# Altium schematic sheet Tp_7seg_Drivers.SchDoc
size A4
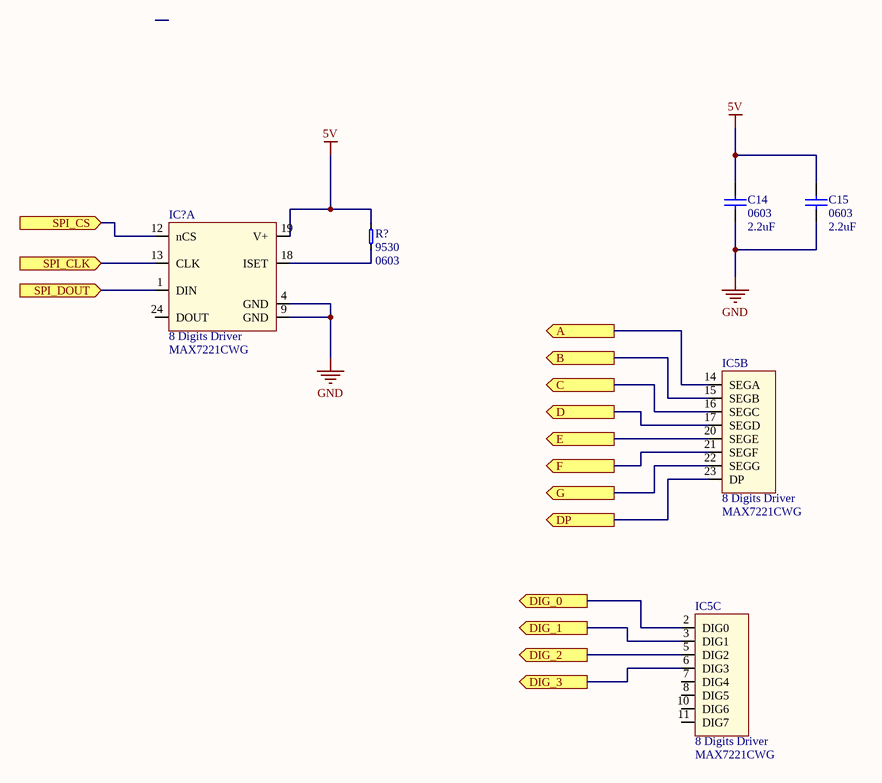
[diagram p0: Tp_7seg_Drivers.SchDoc]

## Parts
C14  0603  value 2.2uF  [RAD-0.3]
C15  0603  value 2.2uF  [RAD-0.3]
IC5  8 Digits Driver  [MAX7221CWG]  (parts B,C of 3)
IC?  8 Digits Driver  [MAX7221CWG]  (part A of 3)
R?  value 9530  Package: 0603  [0603_RES_LD]  (hidden comment: Resistor)

## Ports
A (out), B (out), C (out), D (out), DIG_0 (out), DIG_1 (out), DIG_2 (out), DIG_3 (out), DP (out), E (out), F (out), G (out), SPI_CLK (in), SPI_CS (in), SPI_DOUT (in)

## Nets
5V: C14.2 C15.2 IC?.19(V+) R?.2
GND: C14.1 C15.1 IC?.4(GND) IC?.9(GND)
A: IC5.14(SEGA) ; port A
B: IC5.15(SEGB) ; port B
C: IC5.16(SEGC) ; port C
D: IC5.17(SEGD) ; port D
DIG_0: IC5.2(DIG0) ; port DIG_0
DIG_1: IC5.3(DIG1) ; port DIG_1
DIG_2: IC5.5(DIG2) ; port DIG_2
DIG_3: IC5.6(DIG3) ; port DIG_3
DP: IC5.23(DP) ; port DP
E: IC5.20(SEGE) ; port E
F: IC5.21(SEGF) ; port F
G: IC5.22(SEGG) ; port G
SPI_CLK: IC?.13(CLK) ; port SPI_CLK
SPI_CS: IC?.12(nCS) ; port SPI_CS
SPI_DOUT: IC?.1(DIN) ; port SPI_DOUT
NetIC?_18: IC?.18(ISET) R?.1

Not connected (* = marked no-connect by the designer): IC5 7(DIG4) 8(DIG5) 10(DIG6) 11(DIG7); IC? 24(DOUT)

## Library data of the parts
C14 C15 = Cap: Capacitor; Published: 8-Jun-2000; LatestRevisionDate: 17-Jul-2002; LatestRevisionNote: Re-released for DXP Platform.; PackageReference: RAD-0.3; Publisher: Altium Limited; PackageDescription: Radial Cap, Thru-Hole; 2 Leads; 0.3 in Pin Spacing
IC5 IC? = MAX7221: MAX7221 8 Digit 7 Segments Display; Reference: MAX7221CWG
R? = Resistor: Precision: *